# Altium schematic sheet Block Diagram.SchDoc
size A3; SheetNumber: 1; SheetTotal: 3
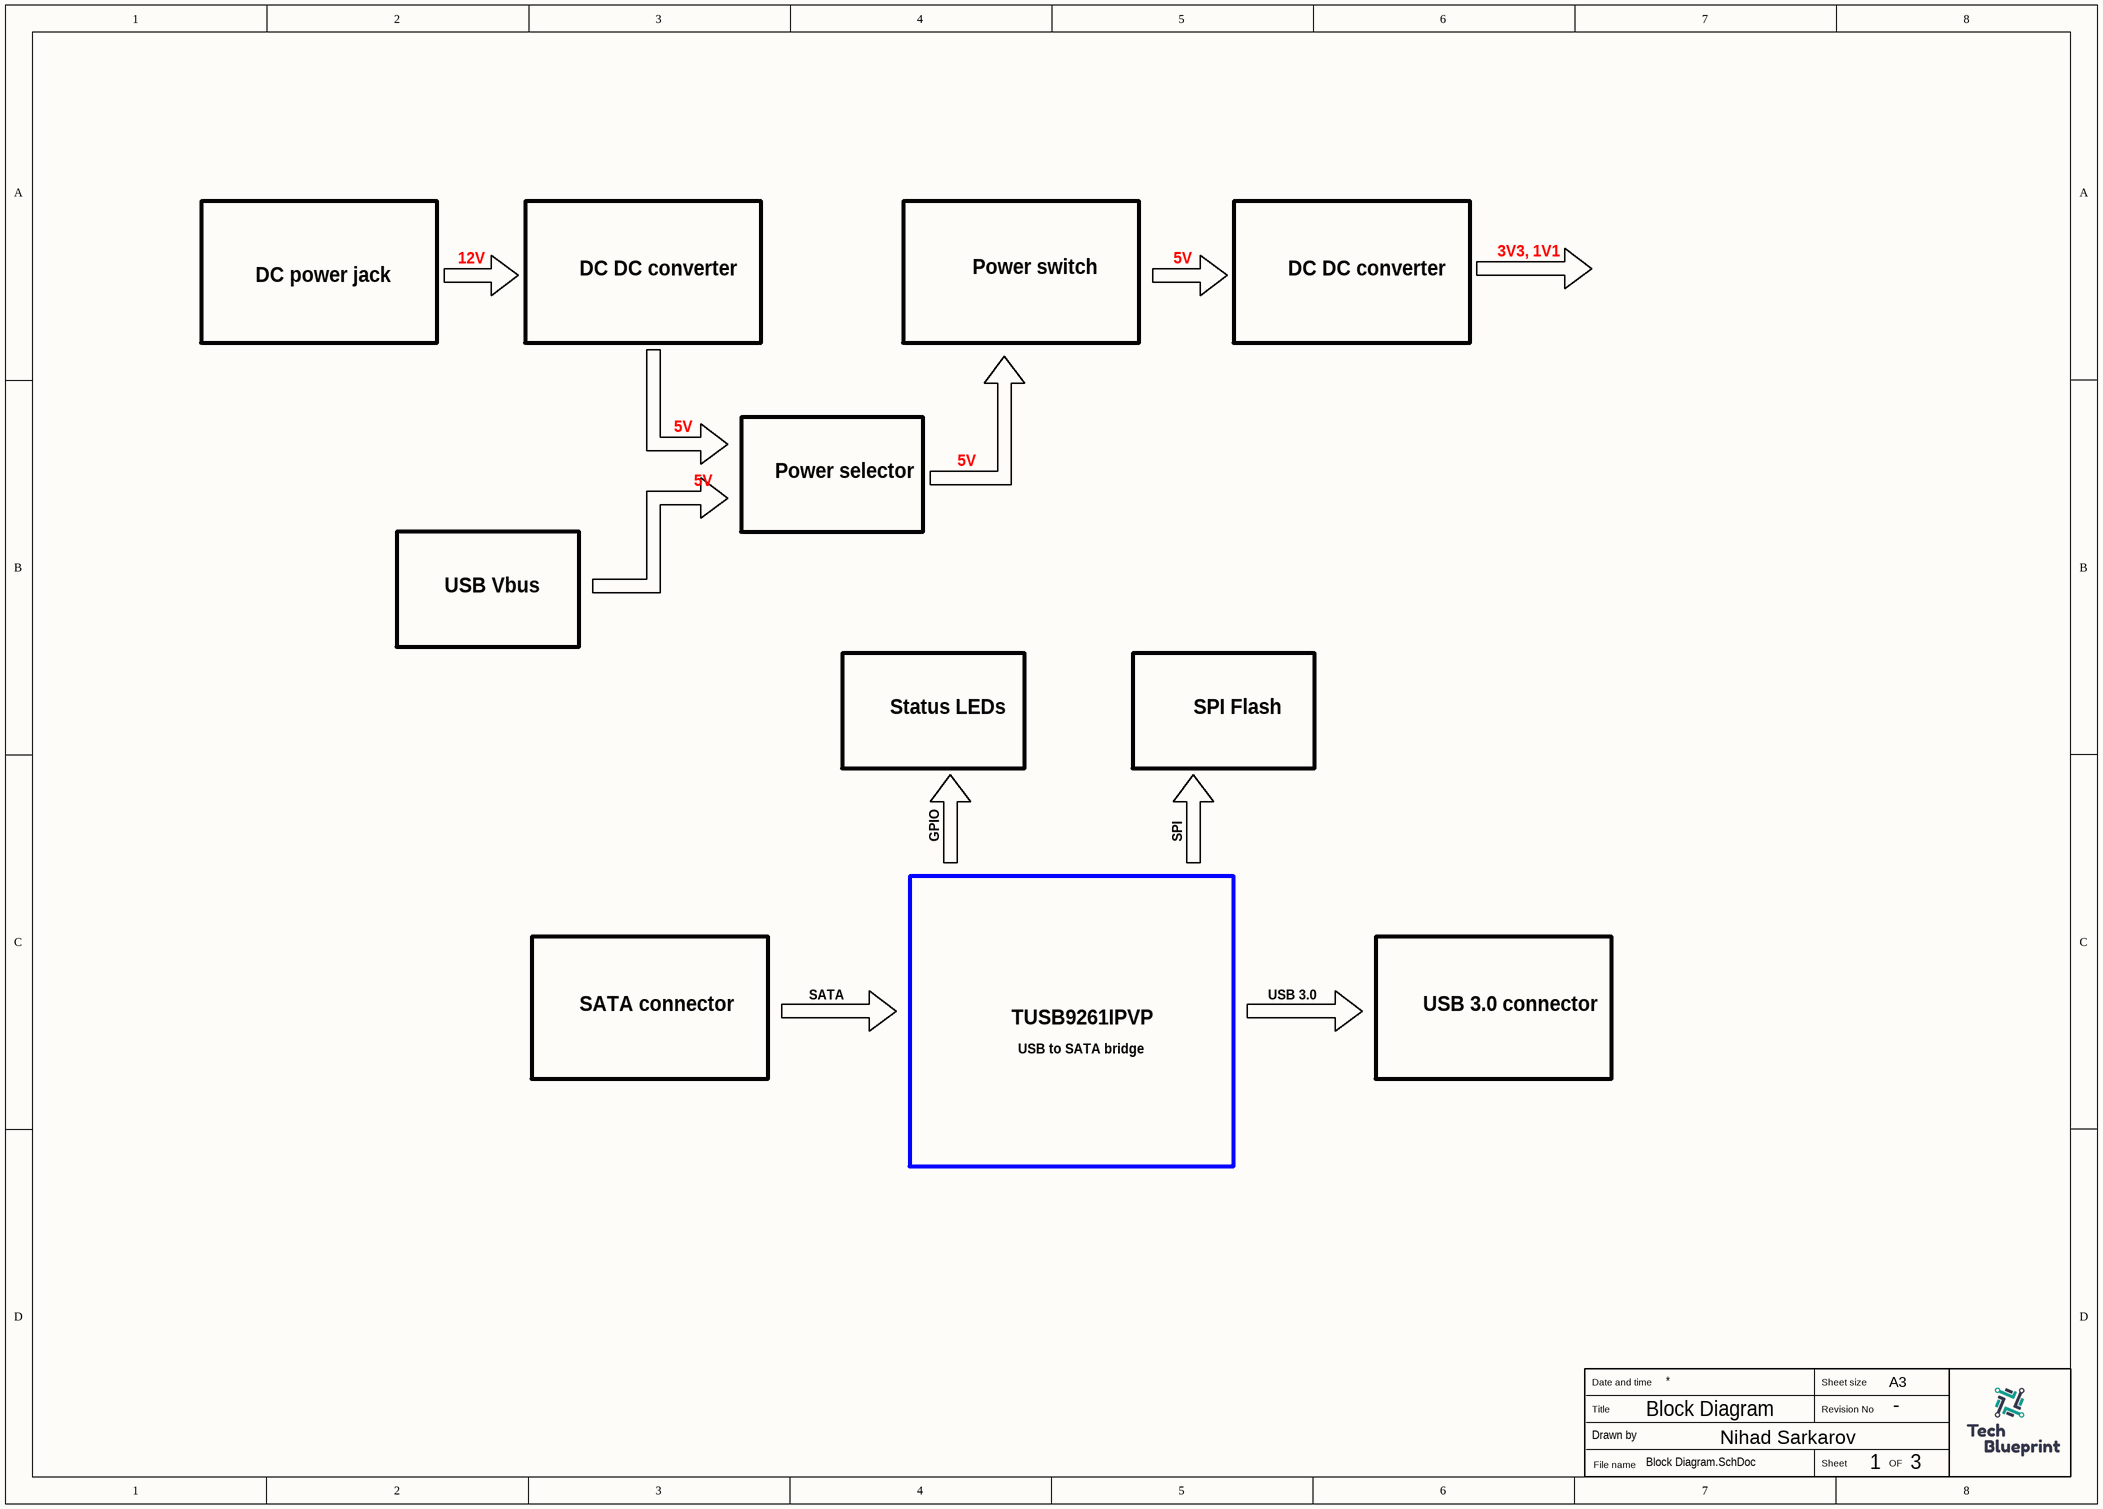
[diagram p0: Block Diagram.SchDoc]

## Notes on the sheet
- DC power jack
- 12V
- DC DC converter
- Power switch
- 5V
- 3V3, 1V1
- Power selector
- USB Vbus
- Status LEDs
- SPI Flash
- GPIO
- SPI
- SATA connector
- SATA
- TUSB9261IPVP
- USB to SATA bridge
- USB 3.0
- USB 3.0 connector
- Block Diagram
- -
- 1
- 3
- Date and time
- Sheet size
- A3
- Title
- Drawn by
- File name
- Nihad Sarkarov
- Sheet
- Revision No
- OF